# Altium project PFC_BUCK_BOOST.PrjPcb
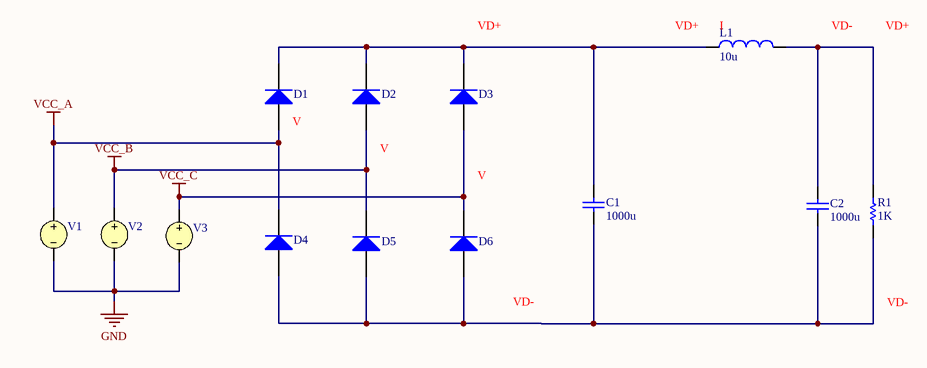
[diagram p0: PFC_BUCK_BOOST.SchDoc]
1 sheet, 13 parts. Net scope: global (net labels, ports and power ports of the same name join across sheets).

## Sheet PFC_BUCK_BOOST.SchDoc
size A4; SheetNumber: 1; SheetTotal: 1

### Parts
C1  value 1000u  (hidden comment: Capacitor)
C2  value 1000u  (hidden comment: Capacitor)
D1  Diode  (value not drawn)
D2  Diode  (value not drawn)
D3  Diode  (value not drawn)
D4  Diode  (value not drawn)
D5  Diode  (value not drawn)
D6  Diode  (value not drawn)
L1  value 10u  (hidden comment: Inductor)
R1  value 1K  (hidden comment: Resistor)
V1  SIN(0 315 50 0 0 0)  (value not drawn)
V2  SIN(0 315 50 0 0 120)  (value not drawn)
V3  SIN(0 315 50 0 0 240)  (value not drawn)

### Nets
GND: V1.2 V2.2 V3.2
VCC_A: D1.1(A) D4.2(K) V1.1
VCC_B: D2.1(A) D5.2(K) V2.1
VCC_C: D3.1(A) D6.2(K) V3.1
NetC1_1: C1.1 C2.1 D4.1(A) D5.1(A) D6.1(A) R1.1
NetC1_2: C1.2 D1.2(K) D2.2(K) D3.2(K) L1.1
NetC2_2: C2.2 L1.2 R1.2

### Library data of the parts
C1 C2 = Capacitor: SimulationGenericComponent: True
D1-D6 = Diode: AF: 1; BV: 0; BV_MAX: 1e99; EG: 1.11; FC: 0.5; IBV: 0.001; ISR: 1e-14; MJSW: 0.33; NTUN: 30; TNOM: 27; XTI: 3; SimulationGenericComponent: True; CJO: 0; CJP: 0; CTA: 0; CTP: 0; FCS: 0.5; FV_MAX: 1e99; IKF: 0; IKR: 0; JSW: 0; JTUN: 0; JTUNSW: 0; KEG: 1; KF: 0; LEVEL: 1; N: 1; NBV: 1; NR: 1; NS: 1; PHP: 1; RS: 0; TCV: 0; TLEV: 0; TLEVC: 0; TM1: 0; TM2: 0; TPB: 0; TPHP: 0; TRS: 0; TRS2: 0; TT: 0; TTT1: 0; TTT2: 0; VJ: 1; XTITUN: 3; IS: 1e-14
L1 = Inductor: SimulationGenericComponent: True; RPAR: 3; RSER: 3
R1 = Resistor: TC1: 0; SimulationGenericComponent: True; TC2: 0
V1 = VSRC: Voltage Source; Note: PCB Footprint - Not required; AC Magnitude: 315; AC Phase: 0; DC Magnitude: 230; Frequency: 50; Published: 8-Jun-2000; LatestRevisionDate: 17-Jul-2002; LatestRevisionNote: Re-released for DXP Platform.; PackageReference: Not Applicable; Publisher: Altium Limited; Offset: 0; Amplitude: 315; Delay: 0; Damping Factor: 0; Phase: 0
V2 = VSRC: Voltage Source; Note: PCB Footprint - Not required; AC Magnitude: 315; AC Phase: 0; DC Magnitude: 230; Frequency: 50; Phase: 120; Published: 8-Jun-2000; LatestRevisionDate: 17-Jul-2002; LatestRevisionNote: Re-released for DXP Platform.; PackageReference: Not Applicable; Publisher: Altium Limited; Offset: 0; Amplitude: 315; Delay: 0; Damping Factor: 0
V3 = VSRC: Voltage Source; Note: PCB Footprint - Not required; AC Magnitude: 315; AC Phase: 0; DC Magnitude: 230; Frequency: 50; Phase: 240; Published: 8-Jun-2000; LatestRevisionDate: 17-Jul-2002; LatestRevisionNote: Re-released for DXP Platform.; PackageReference: Not Applicable; Publisher: Altium Limited; Offset: 0; Amplitude: 315; Delay: 0; Damping Factor: 0